# EAGLE design schaltplan (EAGLE 5.11)
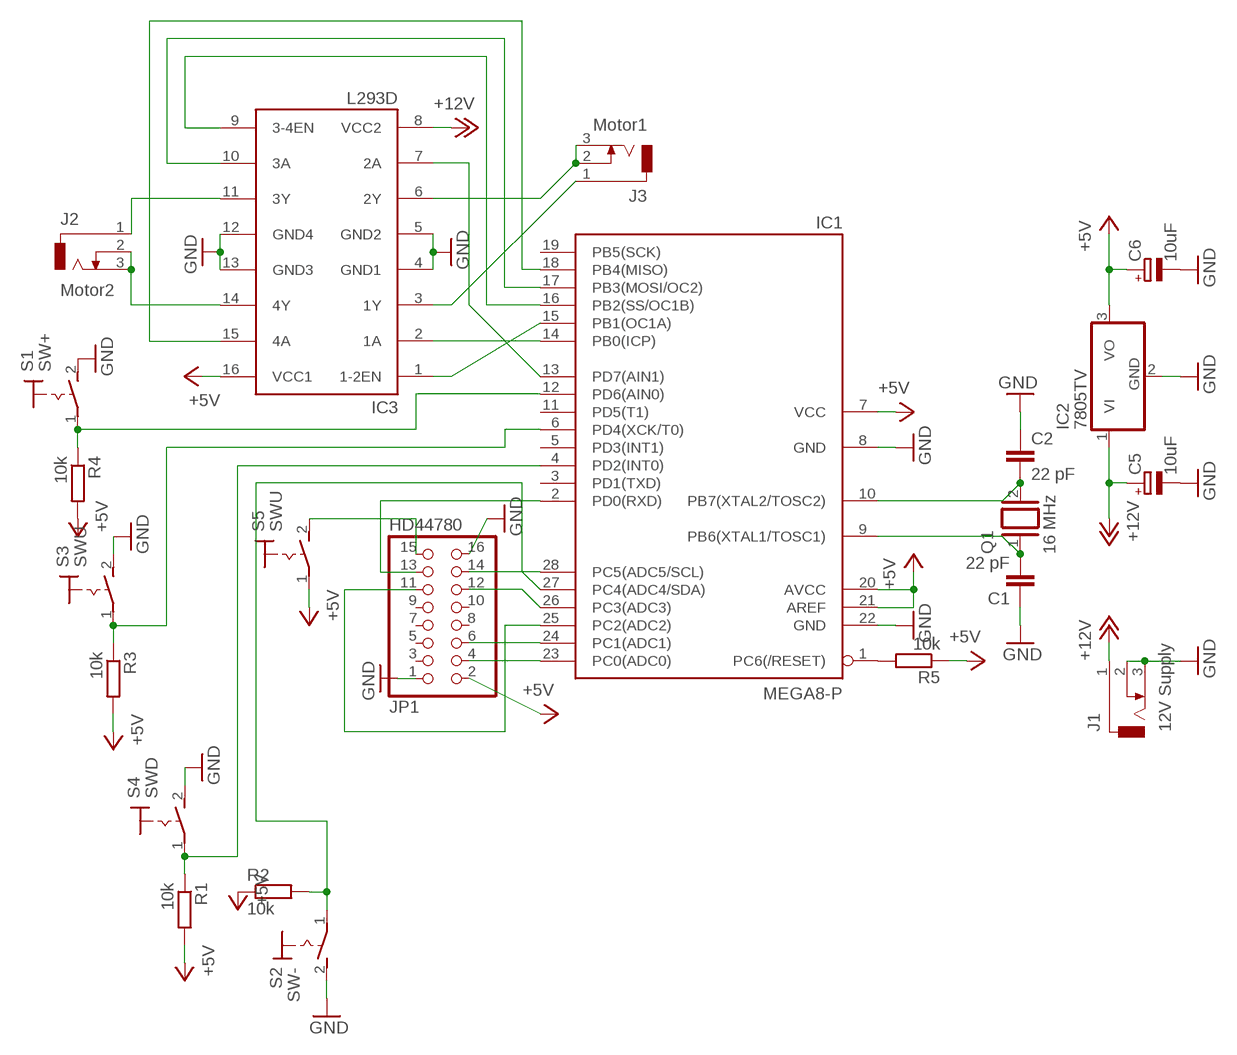
[diagram p0: schematic, sheet 1]

## Parts
C1  22 pF  C2.5/2  [C2.5-2]
C2  22 pF  C2.5/2  [C2.5-2]
C5  10uF  CPOL-EUE2.5-6  [E2,5-6]
C6  10uF  CPOL-EUE2.5-6  [E2,5-6]
IC1  MEGA8-P  [DIL28-3]
IC2  7805TV  [TO220V]
IC3  L293D  [DIL16]
J1  12V Supply  DCJ0303  [DCJ0303]
J2  Motor2  DCJ0303  [DCJ0303]
J3  Motor1  DCJ0303  [DCJ0303]
JP1  HD44780  PINHD-2X8  [2X08]
Q1  16 MHz  XTAL  [Q]
R1  10k  R-EU_0204/5  [0204/5]
R2  10k  R-EU_0204/5  [0204/5]
R3  10k  R-EU_0204/5  [0204/5]
R4  10k  R-EU_0204/5  [0204/5]
R5  10k  R-EU_0204/5  [0204/5]
S1  SW+  MS243  [MS243]
S2  SW-  MS243  [MS243]
S3  SWU  MS243  [MS243]
S4  SWD  MS243  [MS243]
S5  SWU  MS243  [MS243]

## Nets
+5V: C6.+ IC1.7(VCC) IC1.20(AVCC) IC1.21(AREF) IC2.3(VO) IC3.16(VCC1) JP1.2 R1.2 R2.1 R3.2 R4.2 R5.1 S5.1(P)
+12V: C5.+ IC2.1(VI) IC3.8(VCC2) J1.1
GND: C1.1 C2.1 C5.- C6.- IC1.8(GND) IC1.22(GND) IC2.2(GND) IC3.4(GND1) IC3.5(GND2) IC3.12(GND4) IC3.13(GND3) J1.2 J1.3 JP1.1 JP1.16 S1.2(S) S2.2(S) S3.2(S) S4.2(S)
N$1: C1.2 IC1.9(PB6(XTAL1/TOSC1)) Q1.1
N$2: C2.2 IC1.10(PB7(XTAL2/TOSC2)) Q1.2
N$3: IC1.1(PC6(/RESET)) R5.2
N$4: IC1.28(PC5(ADC5/SCL)) JP1.14
N$5: IC1.27(PC4(ADC4/SDA)) JP1.13
N$6: IC1.26(PC3(ADC3)) JP1.12
N$7: IC1.2(PD0(RXD)) R2.2 S2.1(P)
N$8: IC1.24(PC1(ADC1)) JP1.6
N$9: IC1.23(PC0(ADC0)) JP1.4
N$10: IC1.15(PB1(OC1A)) IC3.1(1-2EN)
N$11: IC1.16(PB2(SS/OC1B)) IC3.9(3-4EN)
N$12: IC1.17(PB3(MOSI/OC2)) IC3.10(3A)
N$13: IC1.14(PB0(ICP)) IC3.2(1A)
N$14: IC1.13(PD7(AIN1)) IC3.7(2A)
N$15: IC1.18(PB4(MISO)) IC3.15(4A)
N$16: IC1.25(PC2(ADC2)) JP1.11
N$17: IC1.12(PD6(AIN0)) R4.1 S1.1(P)
N$18: IC3.11(3Y) J2.1
N$19: IC3.14(4Y) J2.2 J2.3
N$20: IC3.3(1Y) J3.1
N$21: IC3.6(2Y) J3.2 J3.3
N$22: IC1.6(PD4(XCK/T0)) R3.1 S3.1(P)
N$23: IC1.4(PD2(INT0)) R1.1 S4.1(P)
N$24: JP1.15 S5.2(S)
Unconnected: IC1.3(PD1(TXD)) IC1.5(PD3(INT1)) IC1.11(PD5(T1)) IC1.19(PB5(SCK)) JP1.3 JP1.5 JP1.7 JP1.8 JP1.9 JP1.10

## Library data of the parts
C1 C2 = capacitor-wima:C: CAPACITOR naming: grid - package width
C5 C6 = rcl:CPOL-EU: POLARIZED CAPACITOR, European symbol
IC1 = atmel:MEGA8-P: MICROCONTROLLER 8 Kbytes FLASH, 1 kbytes SRAM, 512 bytes EEPROM, USART, 4-channel 10 bit ADC, 2-channel 8 bit ADC Pin compatible with Atmega48, ATMega88, ATMega168 Source: avr.lbr; OC_FARNELL: unknown; OC_NEWARK: unknown
IC2 = linear:78*: Positive VOLTAGE REGULATOR Source: http://cache.national.com/ds/LM/LM78L05.pdf http://www.fairchildsemi.com/ds/LM/LM7805.pdf
IC3 = st-microelectronics:L293D: PUSH-PULL 4 CHANNEL DRIVER; MPN: L293D; OC_FARNELL: 9589619; OC_NEWARK: 56P8249
J1-J3 = con-jack:DCJ0303: DC POWER JACK Source: DCJ0303.pdf; OC_FARNELL: unknown; OC_NEWARK: unknown
JP1 = pinhead:PINHD-2X8: PIN HEADER
Q1 = special:XTAL: CRYSTAL
R1-R5 = resistor:R-EU_: RESISTOR, European symbol
S1-S5 = switch:MS243: TOGGLE SWITCH

## Board
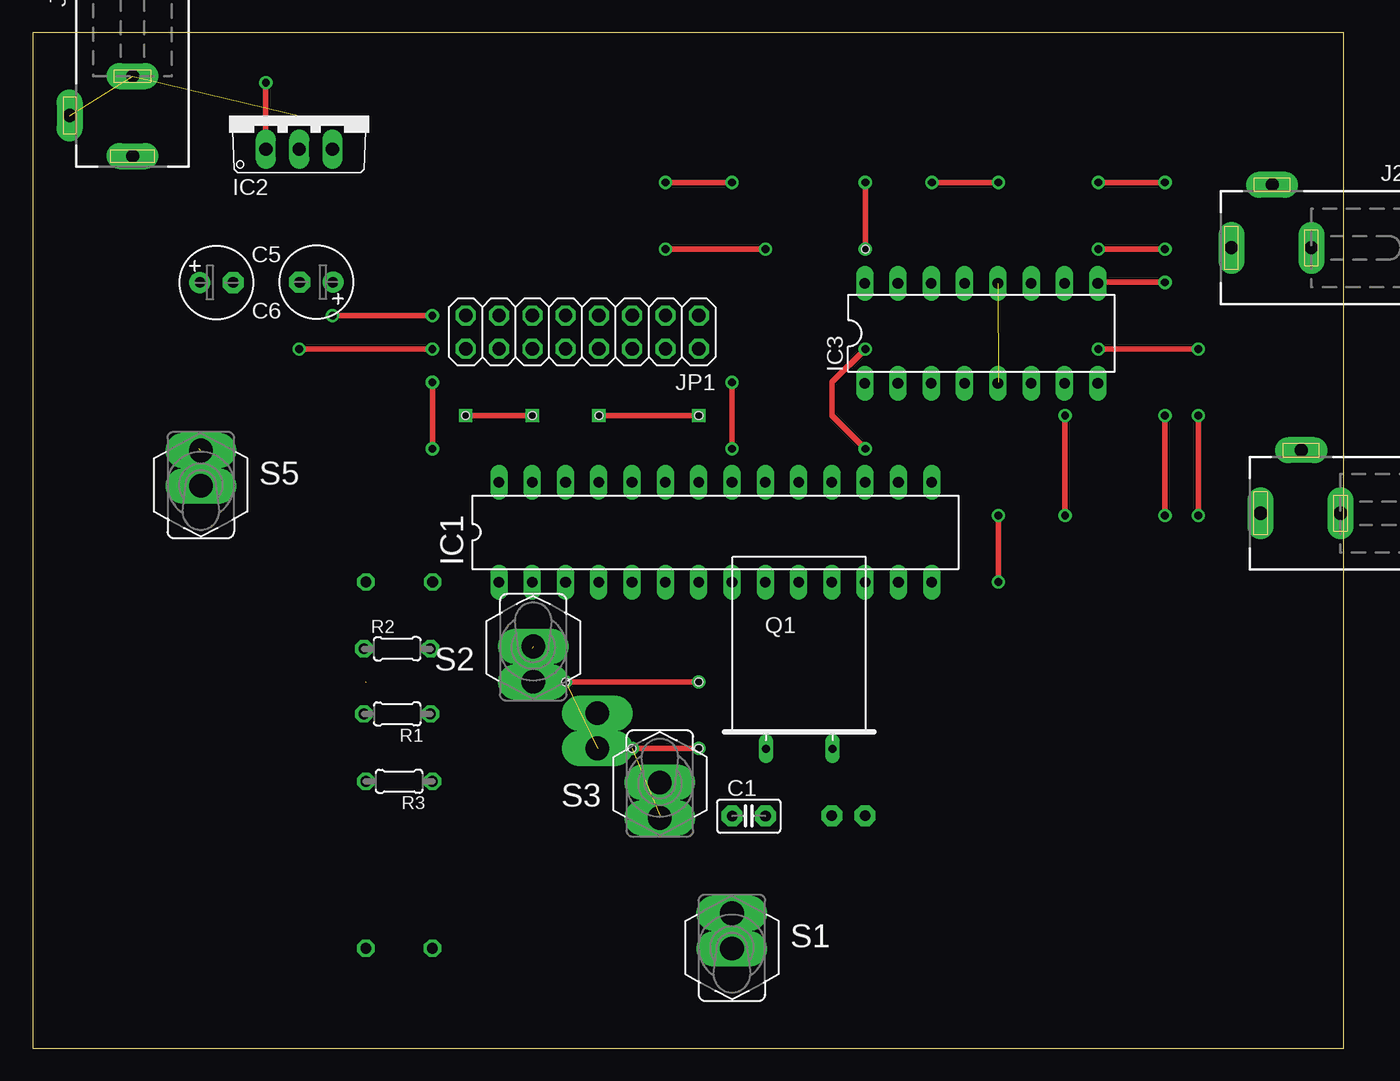
[diagram p1: board, top side]
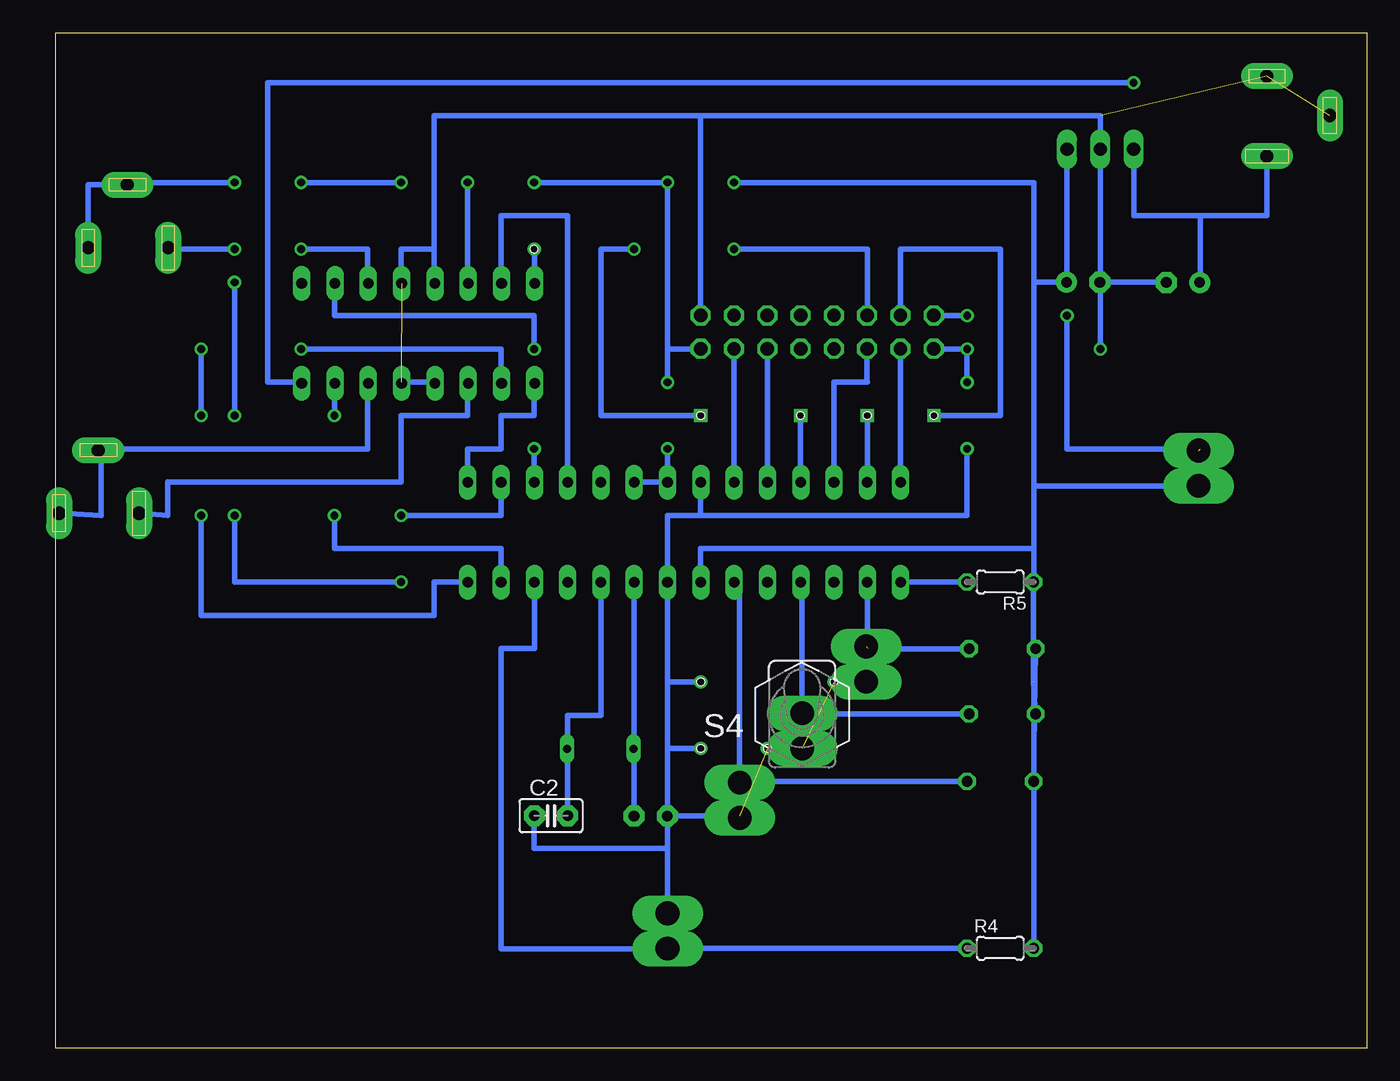
[diagram p2: board, bottom side, seen from below]

Size 100 x 77.46 mm. Coordinates in mm from the lower left corner, seen from the top.
Outline: 0,0 100,0 100,77.46 0,77.46 0,0
Copper layers (1*16): Top 0.035mm / dielectric 1.5mm / Bottom 0.035mm
Design rules "default": minimum track width 10mil, minimum drill 24mil, track to track 8mil, track to pad 8mil, pad to pad 8mil, via to via 8mil, smd to smd 8mil, copper to edge 40mil, drill to drill 8mil, minimum pad ring 10mil, minimum via ring 8mil, stop-mask expansion 4mil, vias tented up to drill 0mil, thermal gap 10mil
Holes 0.6 mm at 38.1,48.26 33.02,48.26 43.18,48.26 50.8,48.26 50.8,27.94 45.72,22.86 50.8,22.86 40.64,27.94 63.5,60.96

### Footprints (pad centres in the part's own frame; a part is rotated, then mirrored left to right if it is on the bottom)
C2.5-2 = drill 0.813 pad 1.6 octagon: 1 -1.27,0; 2 1.27,0
E2,5-6 = drill 0.813 pad 1.6 round: + -1.27,0 | drill 0.813 pad 1.6 octagon: - 1.27,0
DIL28-3 = drill 0.813 long: 1 -16.51,-3.81; 2 -13.97,-3.81; 3 -11.43,-3.81; 4 -8.89,-3.81; 5 -6.35,-3.81; 6 -3.81,-3.81; 7 -1.27,-3.81; 8 1.27,-3.81; 9 3.81,-3.81; 10 6.35,-3.81; 11 8.89,-3.81; 12 11.43,-3.81; 13 13.97,-3.81; 14 16.51,-3.81; 15 16.51,3.81; 16 13.97,3.81; 17 11.43,3.81; 18 8.89,3.81; 19 6.35,3.81; 20 3.81,3.81; 21 1.27,3.81; 22 -1.27,3.81; 23 -3.81,3.81; 24 -6.35,3.81; 25 -8.89,3.81; 26 -11.43,3.81; 27 -13.97,3.81; 28 -16.51,3.81
TO220V = drill 1.016 long: 1 -2.54,-2.54; 2 0,-2.54; 3 2.54,-2.54
DIL16 = drill 0.813 long: 1 -8.89,-3.81; 2 -6.35,-3.81; 3 -3.81,-3.81; 4 -1.27,-3.81; 5 1.27,-3.81; 6 3.81,-3.81; 7 6.35,-3.81; 8 8.89,-3.81; 9 8.89,3.81; 10 6.35,3.81; 11 3.81,3.81; 12 1.27,3.81; 13 -1.27,3.81; 14 -3.81,3.81; 15 -6.35,3.81; 16 -8.89,3.81
DCJ0303 = drill 1 pad 2 long: 1 0,3.1; 2 4.8,0; 3 0,-3
2X08 = drill 1.016 octagon: 1 -8.89,-1.27; 2 -8.89,1.27; 3 -6.35,-1.27; 4 -6.35,1.27; 5 -3.81,-1.27; 6 -3.81,1.27; 7 -1.27,-1.27; 8 -1.27,1.27; 9 1.27,-1.27; 10 1.27,1.27; 11 3.81,-1.27; 12 3.81,1.27; 13 6.35,-1.27; 14 6.35,1.27; 15 8.89,-1.27; 16 8.89,1.27
Q = drill 0.61 long: 1 -2.54,-7.62; 2 2.54,-7.62
0204/5 = drill 0.813 octagon: 1 -2.54,0; 2 2.54,0
MS243 = drill 1.803 pad 2 long: 1 0,-1.346; 2 0,1.346

### Placement (x,y rotation side)
C1  54.61,17.71 0 top
C2  62.22,17.74 0 bottom
C5  14.02,58.41 0 top
C6  21.62,58.43 180 top
IC1  52.06,39.37 0 top
IC2  20.32,71.12 0 top
IC3  72.35,54.53 0 top
J1  7.61,71.15 180 top
J2  94.53,61.06 90 top
J3  96.75,40.81 90 top
JP1  41.91,54.63 180 top
Q1  58.46,30.47 0 top
R1  27.8,25.5 180 top
R2  27.8,30.47 0 top
R3  27.95,20.35 180 top
R4  27.95,7.62 0 bottom
R5  27.96,35.56 180 bottom
S1  53.33,8.94 0 top
S2  38.17,29.3 180 top
S3  47.84,18.91 180 top
S4  43.07,24.21 180 bottom
S5  12.81,44.24 0 top

### Tracks (layer width: path | path; a pad name or v marks a point on that pad's centre or on a via)
+5V  (via drill 0.6)  (1 unrouted)
  Top 0.406: v48.26,66.04 v53.34,66.04 | v63.5,66.04 v63.5,60.96 | v53.34,50.8 v53.34,45.72
  Bottom 0.406: IC2.3 22.86,58.42 C6.+ 25.4,58.43 | 25.4,58.43 25.4,66.04 v48.26,66.04 | v63.5,66.04 v53.34,66.04 53.34,53.34 | R1.2 25.43,27.94 25.43,35.56 | 25.43,35.56 R5.1 | 25.4,22.85 R2.1 | 25.4,22.85 25.4,27.94 | 25.43,35.56 25.4,35.56 25.4,38.1 | 25.4,38.1 25.4,42.89 | 25.4,22.85 25.41,22.85 R3.2 R4.2 | IC1.7 50.8,38.1 25.4,38.1 | 25.4,42.89 S5.1 | 25.4,42.89 25.4,58.43 | v53.34,45.72 IC1.21 | 53.34,53.34 v53.34,50.8 | 53.34,53.34 50.8,53.34 JP1.2 | v63.5,60.96 63.45,60.96 IC3.16 | IC1.21 IC1.20 | IC1.21
+12V  (via drill 0.6)
  Top 0.406: IC2.1 v17.78,73.66
  Bottom 0.406: 12.7,63.5 7.62,63.5 J1.1 | 12.7,63.5 17.78,63.5 IC2.1 | v17.78,73.66 83.82,73.66 83.82,50.8 81.28,50.8 IC3.8 | 12.7,63.5 12.7,58.42 C5.+
GND  (via drill 0.6)  (5 unrouted)
  Top 0.406: v30.48,53.34 v20.32,53.34 | v45.72,22.86 50.8,22.86 | v30.48,45.72 v30.48,50.8
  Bottom 0.406: IC1.22 50.8,40.64 | IC3.5 73.66,50.8 71.12,50.8 IC3.4 | 20.32,58.42 IC2.2 20.32,71.12 50.8,71.12 | 20.32,58.42 15.24,58.42 C5.- | v20.32,53.34 20.32,58.42 | JP1.16 33.02,53.34 v30.48,53.34 v30.48,50.8 | 20.32,58.42 C6.- | 53.34,15.24 53.34,17.78 C1.1 | 53.34,15.24 63.5,15.24 63.5,17.78 C2.1 | S1.2 53.34,10.24 53.34,15.24 | C1.1 53.34,35.56 IC1.8 53.33,40.64 50.8,40.64 | C1.1 47.84,17.71 S3.2 | S4.2 v45.72,22.86 | S2.2 40.64,27.95 40.64,27.94 | 71.12,60.96 71.12,58.42 IC3.13 | 71.12,60.96 71.12,71.12 50.8,71.12 | 71.12,60.96 73.66,60.96 73.66,58.42 IC3.12 | 50.8,71.12 50.8,55.88 JP1.1 | 50.8,40.64 30.48,40.64 v30.48,45.72
N$1
  Bottom 0.406: 55.88,22.86 IC1.9 | C1.2 55.88,17.78 55.88,22.86 | 55.88,22.86 Q1.1
N$2
  Bottom 0.406: 60.96,22.86 60.96,25.4 58.42,25.4 IC1.10 | 60.96,22.86 60.96,17.78 C2.2 | 60.96,22.86 Q1.2
N$3
  Bottom 0.406: R5.2 IC1.1
N$4
  Bottom 0.406: IC1.28 35.56,43.18 JP1.14
N$5  (via drill 0.6)
  Top 0.406: v38.1,48.26 v33.02,48.26
  Bottom 0.406: 38.1,43.18 IC1.27 v38.1,48.26 | v33.02,48.26 27.94,48.26 27.94,60.96 35.56,60.96 JP1.13
N$6
  Bottom 0.406: IC1.26 40.64,50.8 38.1,50.8 | 38.1,50.8 | 38.1,50.8 JP1.12
N$7  (1 unrouted)
  Bottom 0.406: R2.2 35.5,30.47 S2.1 | IC1.2 38.1,30.48
N$8
  Bottom 0.406: IC1.24 45.72,43.18 JP1.6
N$9
  Bottom 0.406: IC1.23 48.26,43.18 JP1.4
N$10
  Bottom 0.406: IC3.1 63.5,50.8 63.5,48.26 66.04,48.26 66.04,45.72 68.58,45.72 IC1.15
N$11  (via drill 0.6)
  Top 0.406: v73.66,40.64 v73.66,35.56 | v86.36,40.64 v86.36,48.26 | v86.36,58.42 81.28,58.42 IC3.9
  Bottom 0.406: v73.66,35.56 86.36,35.56 v86.36,40.64 | v73.66,40.64 66.04,40.64 IC1.16 | v86.36,48.26 v86.36,58.42
N$12  (via drill 0.6)
  Top 0.406: v63.5,53.34 60.96,50.8 60.96,48.26 v63.5,45.72
  Bottom 0.406: v63.5,45.72 IC1.17 | v63.5,53.34 63.5,55.88 78.74,55.88 78.74,58.42 IC3.10
N$13  (via drill 0.6)
  Top 0.406: v88.9,53.34 v81.28,53.34 | v88.9,40.64 v88.9,48.26
  Bottom 0.406: v81.28,53.34 66.04,53.34 66.04,50.8 IC3.2 | v88.9,48.26 v88.9,53.34 | v88.9,40.64 88.9,33.02 71.12,33.02 71.12,35.56 IC1.14
N$14  (via drill 0.6)
  Top 0.406: v78.74,40.64 v78.74,48.26
  Bottom 0.406: v78.74,48.26 78.74,50.8 IC3.7 | v78.74,40.64 78.74,38.1 66.04,38.1 IC1.13
N$15
  Bottom 0.406: IC1.18 60.96,63.5 66.04,63.5 66.04,58.42 IC3.15
N$16  (via drill 0.6)
  Top 0.406: v43.18,48.26 v50.8,48.26 | v55.88,60.96 v48.26,60.96
  Bottom 0.406: IC1.25 v43.18,48.26 | JP1.11 38.1,60.96 v48.26,60.96 | v50.8,48.26 58.42,48.26 58.42,60.96 v55.88,60.96
N$17
  Bottom 0.406: R4.1 53.33,7.62 S1.1 66.04,7.59 66.04,30.48 63.49,30.48 IC1.12
N$18  (via drill 0.6)
  Top 0.406: v81.28,60.96 v86.36,60.96
  Bottom 0.406: v86.36,60.96 91.43,60.96 | v81.28,60.96 76.2,60.96 76.2,58.42 IC3.11 | 91.43,60.96 91.44,60.96 | 91.43,60.96 J2.1
N$19  (via drill 0.6)
  Top 0.406: v68.58,66.04 v73.66,66.04 | v81.28,66.04 v86.36,66.04
  Bottom 0.406: v73.66,66.04 v81.28,66.04 | v86.36,66.04 93.98,66.04 J2.2 97.53,65.86 J2.3 | v68.58,66.04 68.58,58.42 IC3.14
N$20
  Bottom 0.406: J3.1 91.44,40.64 91.44,43.18 73.66,43.18 73.66,48.26 68.58,48.26 68.58,50.8 IC3.3
N$21
  Bottom 0.406: IC3.6 76.2,50.8 76.2,45.72 93.98,45.72 | J3.3 96.52,40.64 96.52,45.72 93.98,45.72 | 93.98,45.72 J3.2
N$22
  Bottom 0.406: IC1.6 47.84,35.56 S3.1 47.84,20.35 R3.1
N$23
  Bottom 0.406: R1.1 43.07,25.5 S4.1 43.07,35.56 IC1.4
N$24  (via drill 0.6)  (1 unrouted)
  Top 0.406: v22.86,55.88 v30.48,55.88
  Bottom 0.406: 12.7,45.72 22.86,45.72 v22.86,55.88 | v30.48,55.88 33.02,55.88 JP1.15
N$25  (via drill 0.6)
  Bottom 0.406: v50.8,22.86 53.34,22.86
N$26  (via drill 0.6)
  Top 0.406: v40.64,27.94 v50.8,27.94
  Bottom 0.406: v50.8,27.94 53.34,27.94